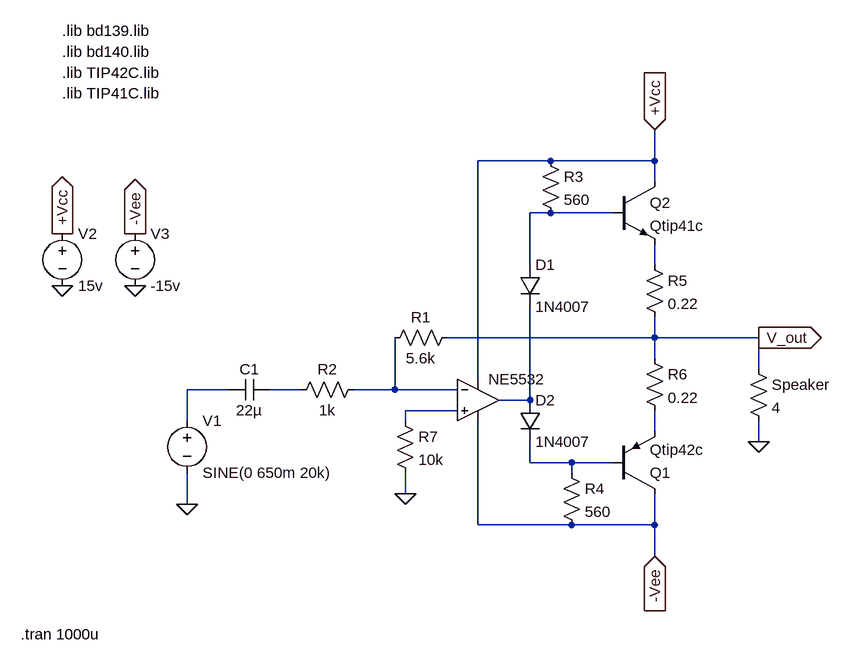
[diagram p0: schematic Modified Class AB amplifier.asc]
Modified Class AB amplifier.asc, the LTspice schematic file:
Version 4.1
SHEET 1 1888 680
WIRE 640 -160 528 -160
WIRE 800 -160 800 -208
WIRE 800 -160 640 -160
WIRE 800 -128 800 -160
WIRE 640 -80 608 -80
WIRE 736 -80 640 -80
WIRE 608 0 608 -80
WIRE 800 0 800 -32
WIRE 800 112 800 80
WIRE 800 112 480 112
WIRE 960 112 800 112
WIRE 800 144 800 112
WIRE 960 160 960 112
WIRE 528 176 528 -160
WIRE 144 192 80 192
WIRE 256 192 208 192
WIRE 400 192 400 112
WIRE 400 192 336 192
WIRE 496 192 400 192
WIRE 608 208 608 64
WIRE 608 208 560 208
WIRE 496 224 416 224
WIRE 80 240 80 192
WIRE 416 240 416 224
WIRE 800 256 800 224
WIRE 960 272 960 240
WIRE 608 304 608 272
WIRE 672 304 608 304
WIRE 736 304 672 304
WIRE 672 320 672 304
WIRE 416 352 416 320
WIRE 80 368 80 320
WIRE 528 400 528 240
WIRE 672 400 528 400
WIRE 800 400 800 352
WIRE 800 400 672 400
WIRE 800 448 800 400
FLAG 960 112 V_out
IOPIN 960 112 Out
FLAG 416 352 0
FLAG 960 272 0
FLAG 80 368 0
FLAG -112 32 0
FLAG 0 32 0
FLAG -112 -48 +Vcc
IOPIN -112 -48 Out
FLAG 0 -48 -Vee
IOPIN 0 -48 Out
FLAG 800 -208 +Vcc
IOPIN 800 -208 In
FLAG 800 448 -Vee
IOPIN 800 448 In
SYMBOL pnp 736 352 M180
SYMATTR InstName Q1
SYMATTR Value Qtip42c
SYMBOL npn 736 -128 R0
SYMATTR InstName Q2
SYMATTR Value Qtip41c
SYMBOL res 944 144 R0
SYMATTR InstName Speaker
SYMATTR Value 4
SYMBOL res 496 96 R90
WINDOW 0 0 56 VBottom 2
WINDOW 3 32 56 VTop 2
SYMATTR InstName R1
SYMATTR Value 5.6k
SYMBOL res 352 176 R90
WINDOW 0 0 56 VBottom 2
WINDOW 3 32 56 VTop 2
SYMATTR InstName R2
SYMATTR Value 1k
SYMBOL voltage 80 224 R0
WINDOW 123 0 0 Left 0
WINDOW 39 0 0 Left 0
SYMATTR InstName V1
SYMATTR Value SINE(0 650m 20k)
SYMBOL voltage -112 -64 R0
SYMATTR InstName V2
SYMATTR Value 15v
SYMBOL voltage 0 -64 R0
SYMATTR InstName V3
SYMATTR Value -15v
SYMBOL diode 592 0 R0
SYMATTR InstName D1
SYMATTR Value 1N4007
SYMBOL diode 592 208 R0
SYMATTR InstName D2
SYMATTR Value 1N4007
SYMBOL res 624 -176 R0
SYMATTR InstName R3
SYMATTR Value 560
SYMBOL res 656 304 R0
SYMATTR InstName R4
SYMATTR Value 560
SYMBOL cap 208 176 R90
WINDOW 0 0 32 VBottom 2
WINDOW 3 32 32 VTop 2
SYMATTR InstName C1
SYMATTR Value 22µ
SYMBOL res 784 -16 R0
SYMATTR InstName R5
SYMATTR Value 0.22
SYMBOL res 784 128 R0
SYMATTR InstName R6
SYMATTR Value 0.22
SYMBOL res 400 224 R0
SYMATTR InstName R7
SYMATTR Value 10k
SYMBOL OpAmps\\UniversalOpAmp2 528 208 R0
SYMATTR InstName NE5532
SYMATTR Value2 Avol=100k GBW=10Meg Slew=9Meg
SYMATTR SpiceLine Ilimit=38m Rail=0 Vos=0
TEXT -112 -360 Left 2 !.lib bd139.lib
TEXT -112 -328 Left 2 !.lib bd140.lib
TEXT -176 568 Left 2 !.tran 1000u
TEXT -112 -296 Left 2 !.lib TIP42C.lib
TEXT -112 -264 Left 2 !.lib TIP41C.lib

The netlist it stands for:
* Modified Class AB amplifier.asc
Q1 -Vee N009 N008 0 Qtip42c
Q2 +Vcc N001 N002 0 Qtip41c
R§Speaker V_out 0 4
R1 V_out N005 5.6k
R2 N005 N004 1k
V1 N003 0 SINE(0 650m 20k)
V2 +Vcc 0 15v
V3 -Vee 0 -15v
D1 N001 N006 1N4007
D2 N006 N009 1N4007
R3 +Vcc N001 560
R4 N009 -Vee 560
C1 N004 N003 22µ
R5 N002 V_out 0.22
R6 V_out N008 0.22
R7 N007 0 10k
X§NE5532 N007 N005 +Vcc -Vee N006 level2 Avol=100k GBW=10Meg Slew=9Meg Ilimit=38m Rail=0 Vos=0 En=0 Enk=0 In=0 Ink=0 Rin=500Meg  ; pins In+ In- V+ V- OUT
.model D D
.lib standard.dio
.model NPN NPN
.model PNP PNP
.lib standard.bjt
.lib bd139.lib
.lib bd140.lib
.tran 1000u
.lib TIP42C.lib
.lib TIP41C.lib
.lib UniversalOpAmp2.lib
.backanno
.end